# EAGLE design tick-wifi-mk-1.0 (EAGLE 7.5.0)
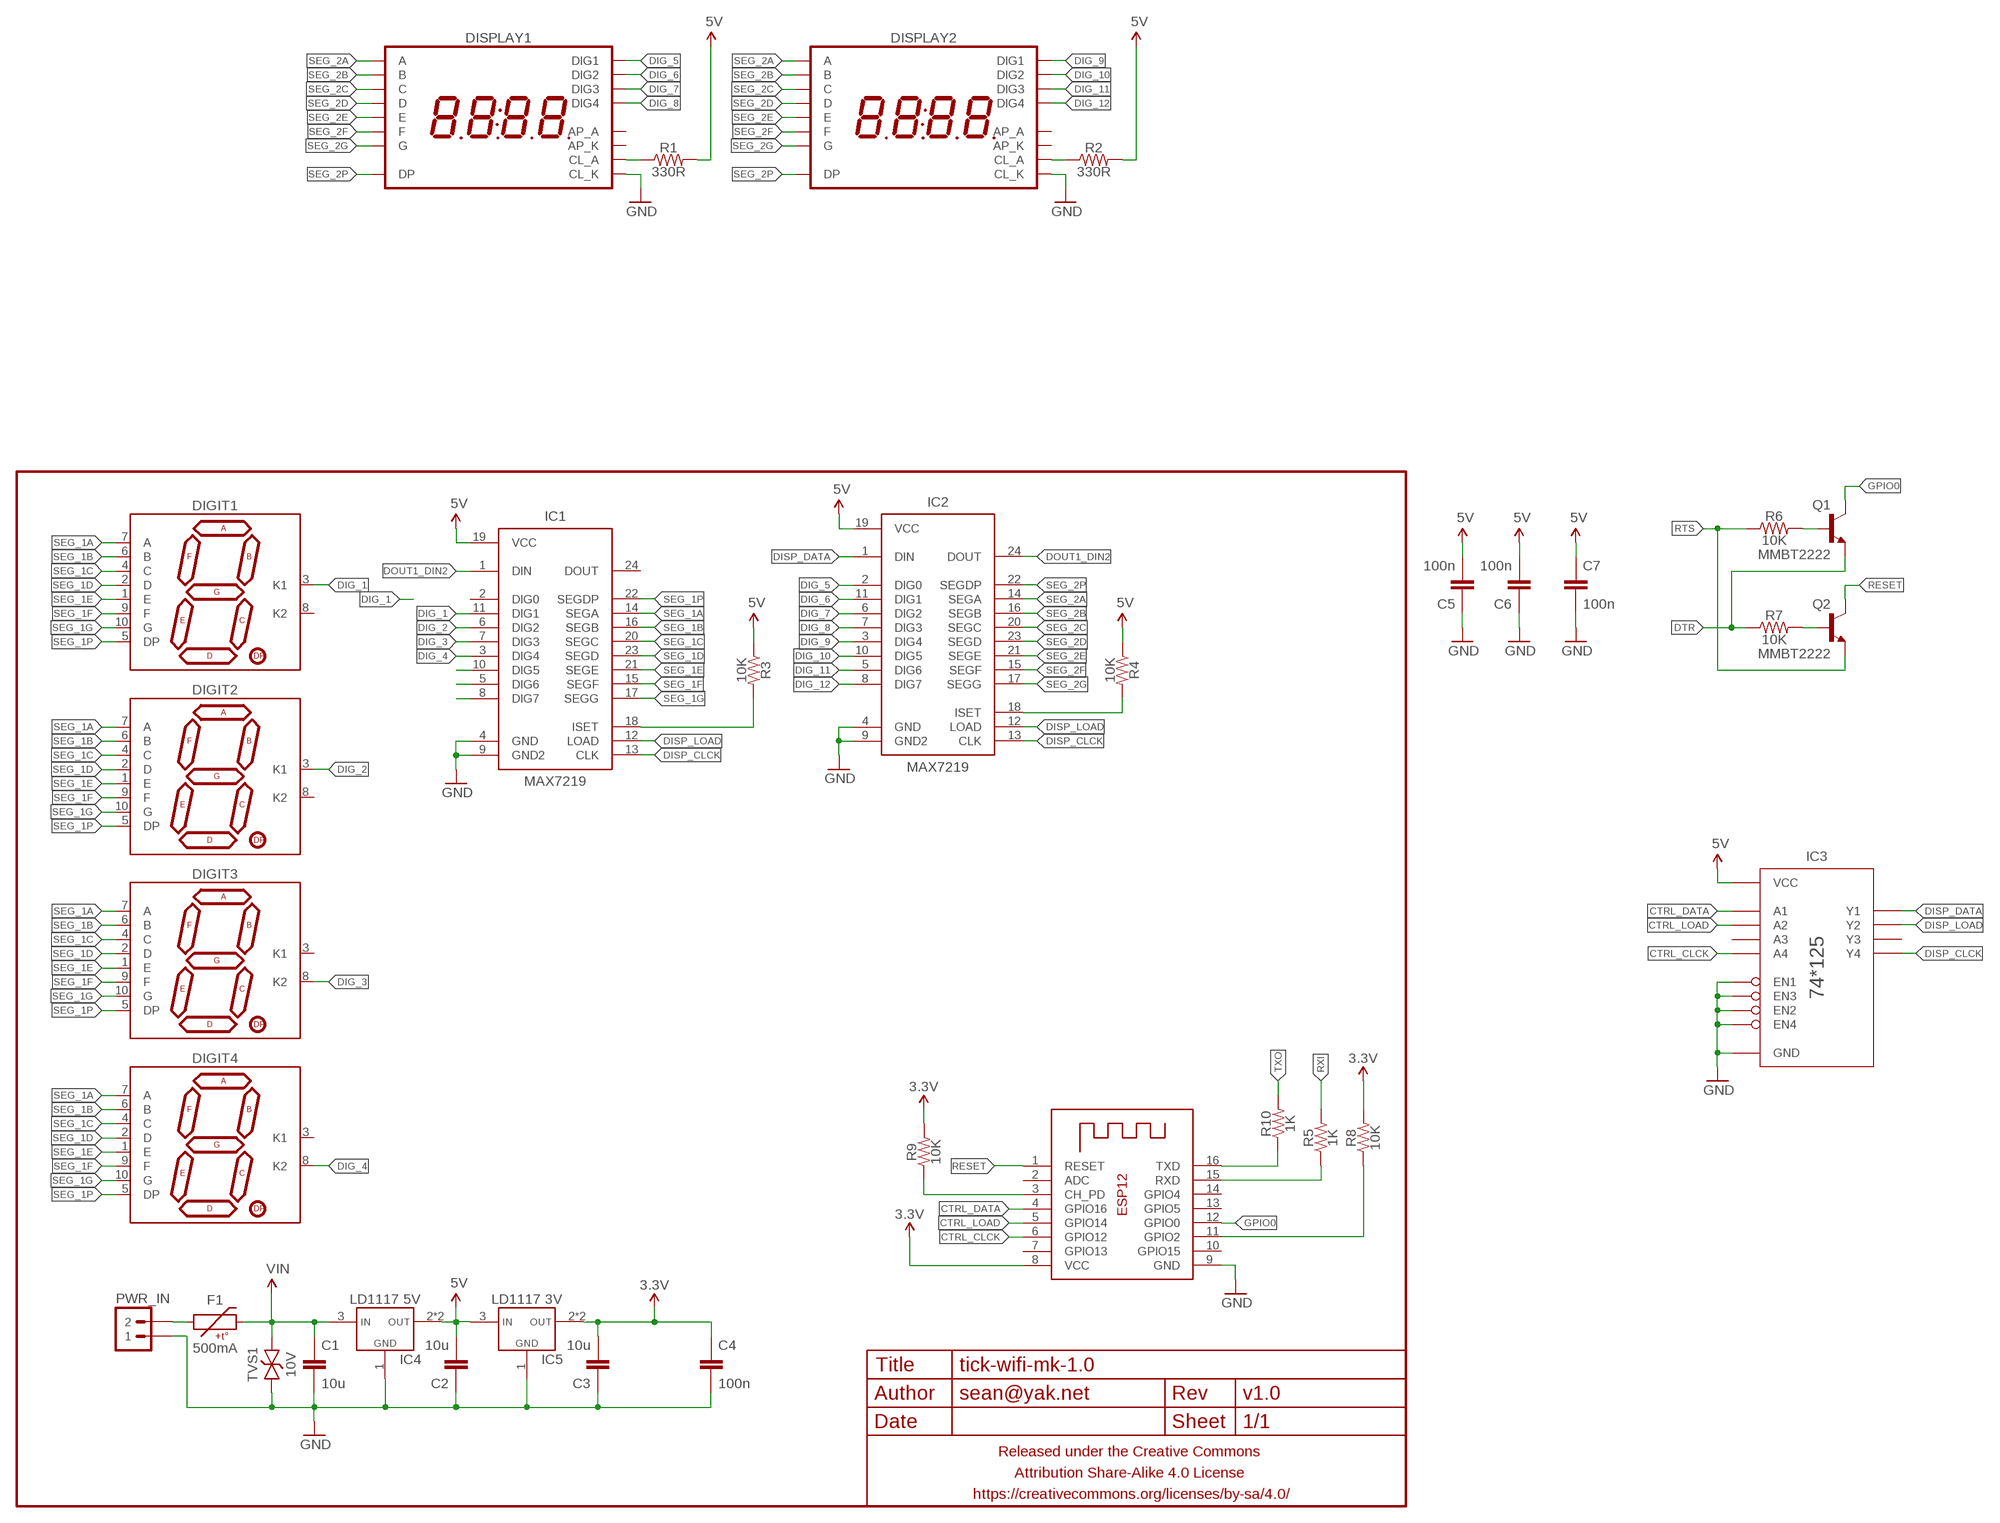
[diagram p0: schematic, sheet 1]

## Parts
C1  10u  CAPACITOR-CERAMICC1210  [C1210]
C2  10u  CAPACITOR-CERAMICC1210  [C1210]
C3  10u  CAPACITOR-CERAMICC1210  [C1210]
C4  100n  CAPACITOR-CERAMICC0603  [C0603]
C5  100n  CAPACITOR-CERAMICC0603  [C0603]
C6  100n  CAPACITOR-CERAMICC0603  [C0603]
C7  100n  CAPACITOR-CERAMICC0603  [C0603]
DIGIT1  7SEG_1DIGPTH-25.4MM-BARE  [7SEG_1DIG_25.4MM_NOSILK]
DIGIT2  7SEG_1DIGPTH-25.4MM-BARE  [7SEG_1DIG_25.4MM_NOSILK]
DIGIT3  7SEG_1DIGPTH-25.4MM-BARE  [7SEG_1DIG_25.4MM_NOSILK]
DIGIT4  7SEG_1DIGPTH-25.4MM-BARE  [7SEG_1DIG_25.4MM_NOSILK]
DISPLAY1  7SEG_4DIGIT_COLON_APOS  [7SEG_4DIG_10MM]
DISPLAY2  7SEG_4DIGIT_COLON_APOS  [7SEG_4DIG_10MM]
F1  500mA  PTCPTC-1210  [PTC-1210]
FRAME1  FRAME-LETTERNO_PACKAGE  [DUMMY]
IC1  MAX7219  MAX7219SOIC-W  [SO24W]
IC2  MAX7219  MAX7219SOIC-W  [SO24W]
IC3  74HC125  74125SOIC14  [SO14]
IC4  LD1117 5V  VREG_1117SOT223  [SOT223]
IC5  LD1117 3V  VREG_1117SOT223  [SOT223]
PWR_IN  M02PTH-CENTERED-R+  [1X02-CENTER-R+]
Q1  MMBT2222  TRANSISTOR_NPNMMBT2222A  [SOT23]
Q2  MMBT2222  TRANSISTOR_NPNMMBT2222A  [SOT23]
R1  330R  RESISTORR0805  [R0805]
R2  330R  RESISTORR0805  [R0805]
R3  10K  RESISTORR0603  [R0603]
R4  10K  RESISTORR0603  [R0603]
R5  1K  RESISTORR0603  [R0603]
R6  10K  RESISTORR0603  [R0603]
R7  10K  RESISTORR0603  [R0603]
R8  10K  RESISTORR0603  [R0603]
R9  10K  RESISTORR0603  [R0603]
R10  1K  RESISTORR0603  [R0603]
TVS1  10V  TVSSMA  [SMA-DIODE-TVS-BIDIR]
U1  ESP-12  [ESP-12]

## Nets
3.3V: C3.2 C4.1 IC5.2(VOUT) IC5.4(VOUT) R8.2 R9.2 U1.8(VCC)
5V: C2.2 C5.2 C6.2 C7.1 IC1.19(VCC) IC2.19(VCC) IC3.14(VCC) IC4.2(VOUT) IC4.4(VOUT) IC5.3(VIN) R1.2 R2.2 R3.1 R4.1
CTRL_CLCK: IC3.12(A4) U1.6(GPIO12)
CTRL_DATA: IC3.2(A1) U1.4(GPIO16)
CTRL_LOAD: IC3.5(A2) U1.5(GPIO14)
DIG_1: DIGIT1.3(K1) IC1.11(DIG1)
DIG_2: DIGIT2.3(K1) IC1.6(DIG2)
DIG_3: DIGIT3.8(K2) IC1.7(DIG3)
DIG_4: DIGIT4.8(K2) IC1.3(DIG4)
DIG_5: DISPLAY1.1(DIG1) IC2.2(DIG0)
DIG_6: DISPLAY1.2(DIG2) IC2.11(DIG1)
DIG_7: DISPLAY1.6(DIG3) IC2.6(DIG2)
DIG_8: DISPLAY1.8(DIG4) IC2.7(DIG3)
DIG_9: DISPLAY2.1(DIG1) IC2.3(DIG4)
DIG_10: DISPLAY2.2(DIG2) IC2.10(DIG5)
DIG_11: DISPLAY2.6(DIG3) IC2.5(DIG6)
DIG_12: DISPLAY2.8(DIG4) IC2.8(DIG7)
DISP_CLCK: IC1.13(CLK) IC2.13(CLK) IC3.11(Y4)
DISP_DATA: IC2.1(DIN) IC3.3(Y1)
DISP_LOAD: IC1.12(LOAD) IC2.12(LOAD) IC3.6(Y2)
DOUT1_DIN2: IC1.1(DIN) IC2.24(DOUT)
DTR: Q1.2(E) R7.1
GND: C1.2 C2.1 C3.1 C4.2 C5.1 C6.1 C7.2 DISPLAY1.12(CL_K) DISPLAY2.12(CL_K) IC1.4(GND) IC1.9(GND2) IC2.4(GND) IC2.9(GND2) IC3.1(EN1) IC3.4(EN2) IC3.7(GND) IC3.10(EN3) IC3.13(EN4) IC4.1(GND) IC5.1(GND) PWR_IN.1 TVS1.1 U1.9(GND)
GPIO0: Q1.3(C) U1.12(GPIO0)
N$1: F1.1 PWR_IN.2
N$2: IC2.18(ISET) R4.2
N$3: DISPLAY1.4(CL_A) R1.1
N$4: IC1.18(ISET) R3.2
N$5: DISPLAY2.4(CL_A) R2.1
N$6: R5.1 U1.15(RXD)
N$7: IC1.10(DIG5)
N$8: IC1.5(DIG6)
N$9: IC1.8(DIG7)
N$10: R8.1 U1.11(GPIO2)
N$11: Q1.1(B) R6.2
N$12: Q2.1(B) R7.2
N$13: R9.1 U1.3(CH_PD)
N$14: R10.1 U1.16(TXD)
RESET: Q2.3(C) U1.1(RESET)
RTS: Q2.2(E) R6.1
RXI: R5.2
SEG_1A: DIGIT1.7(A) DIGIT2.7(A) DIGIT3.7(A) DIGIT4.7(A) IC1.14(SEGA)
SEG_1B: DIGIT1.6(B) DIGIT2.6(B) DIGIT3.6(B) DIGIT4.6(B) IC1.16(SEGB)
SEG_1C: DIGIT1.4(C) DIGIT2.4(C) DIGIT3.4(C) DIGIT4.4(C) IC1.20(SEGC)
SEG_1D: DIGIT1.2(D) DIGIT2.2(D) DIGIT3.2(D) DIGIT4.2(D) IC1.23(SEGD)
SEG_1E: DIGIT1.1(E) DIGIT2.1(E) DIGIT3.1(E) DIGIT4.1(E) IC1.21(SEGE)
SEG_1F: DIGIT1.9(F) DIGIT2.9(F) DIGIT3.9(F) DIGIT4.9(F) IC1.15(SEGF)
SEG_1G: DIGIT1.10(G) DIGIT2.10(G) DIGIT3.10(G) DIGIT4.10(G) IC1.17(SEGG)
SEG_1P: DIGIT1.5(DP) DIGIT2.5(DP) DIGIT3.5(DP) DIGIT4.5(DP) IC1.22(SEGDP)
SEG_2A: DISPLAY1.14(A) DISPLAY2.14(A) IC2.14(SEGA)
SEG_2B: DISPLAY1.16(B) DISPLAY2.16(B) IC2.16(SEGB)
SEG_2C: DISPLAY1.13(C) DISPLAY2.13(C) IC2.20(SEGC)
SEG_2D: DISPLAY1.3(D) DISPLAY2.3(D) IC2.23(SEGD)
SEG_2E: DISPLAY1.5(E) DISPLAY2.5(E) IC2.21(SEGE)
SEG_2F: DISPLAY1.11(F) DISPLAY2.11(F) IC2.15(SEGF)
SEG_2G: DISPLAY1.15(G) DISPLAY2.15(G) IC2.17(SEGG)
SEG_2P: DISPLAY1.7(DP) DISPLAY2.7(DP) IC2.22(SEGDP)
TXO: R10.2
VIN: C1.1 F1.2 IC4.3(VIN) TVS1.2
Unconnected: DIGIT1.8(K2) DIGIT2.8(K2) DIGIT3.3(K1) DIGIT4.3(K1) DISPLAY1.9(AP_K) DISPLAY1.10(AP_A) DISPLAY2.9(AP_K) DISPLAY2.10(AP_A) IC1.2(DIG0) IC1.24(DOUT) IC3.8(Y3) IC3.9(A3) U1.2(ADC) U1.7(GPIO13) U1.10(GPIO15) U1.13(GPIO5) U1.14(GPIO4)

## Library data of the parts
C1-C7 = a_parts:CAPACITOR-CERAMIC: CAPACITOR, European symbol
DIGIT1-DIGIT4 = a_parts:7SEG_1DIG
DISPLAY1 DISPLAY2 = a_parts:7SEG_4DIGIT_COLON_APOS
F1 = a_parts:PTC: Resettable Fuse PTC Resettable Fuse. Spark Fun Electronics SKU : COM-08357
FRAME1 = a_parts:FRAME-LETTER: Schematic Frame Standard 8.5x11 US Letter frame; DESIGNER: sean@yak.net; VERSION: v1.0
IC1 IC2 = a_parts:MAX7219: 8-digit, 8-segment LED display driver, serial input
IC3 = a_parts:74*125
IC4 IC5 = a_parts:VREG_1117
PWR_IN = a_parts:M02: Standard 2-pin 0.1" header. Use with - straight break away headers ( PRT-00116) - right angle break away headers (PRT-00553) - swiss pins (PRT-00743) - machine pins (PRT-00117) - female headers (PRT-00115) Molex polarized connector foot print use with: PRT-08233 with associated crimp pins and housings. 2.54_SCREWTERM for use with PRT-10571. 3.5mm Screw Terminal footprints for PRT-08084 5mm Screw Terminal footprints for use with PRT-08433
Q1 Q2 = a_parts:TRANSISTOR_NPN: Generic NPN BJT MMBT2222A - TRANS-08049 (SOT-23, 1A 40V) MPSA42 - TRANS-09116 (SOT-23, 500mA 300V) MMBT5088LT1G - TRANS-11160 (SOT-23, 50 mA 30V) BC547 - COM-08928 <http://www.sparkfun.com/products/8928> (TO-92 45V 100mA) (1.Collector 2.Base 3.Emitter) 2N3904 - COM-00521 <http://www.sparkfun.com/products/521> (TO-92 40V 200mA) (1.Emitter 2.Base 3.Collector) P2N2222A - COM-12852 <http://www.sparkfun.com/products/12852> (TO-92 40V 600mA) (1.Collector 2.Base 3.Emitter)
R1-R10 = a_parts:RESISTOR: RESISTOR, American symbol
TVS1 = a_parts:TVS: Transient voltage suppressor- prevents ESD on inputs. Ignore package description- MBRA140 is NOT this type of part!!!
U1 = a_parts:ESP-12

## Board
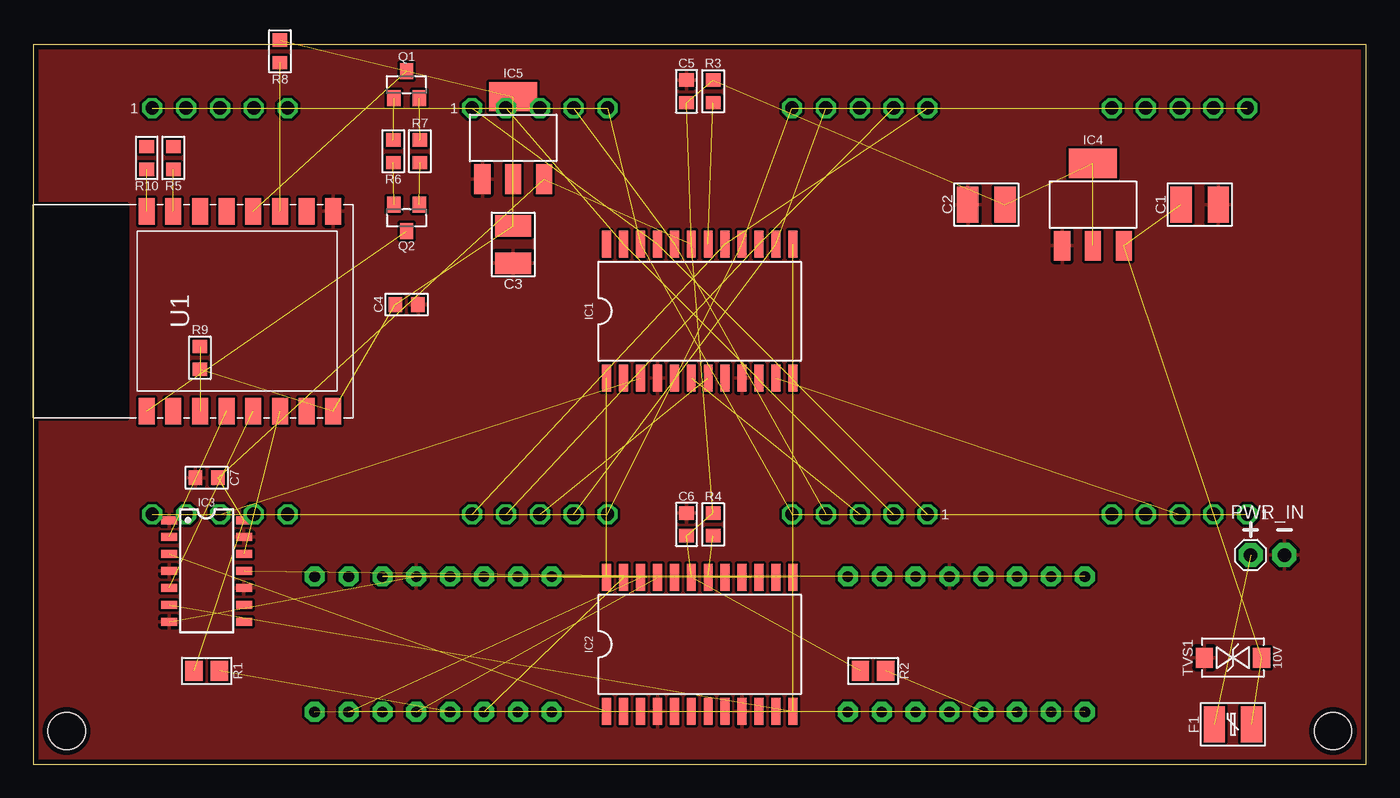
[diagram p1: board, top side]
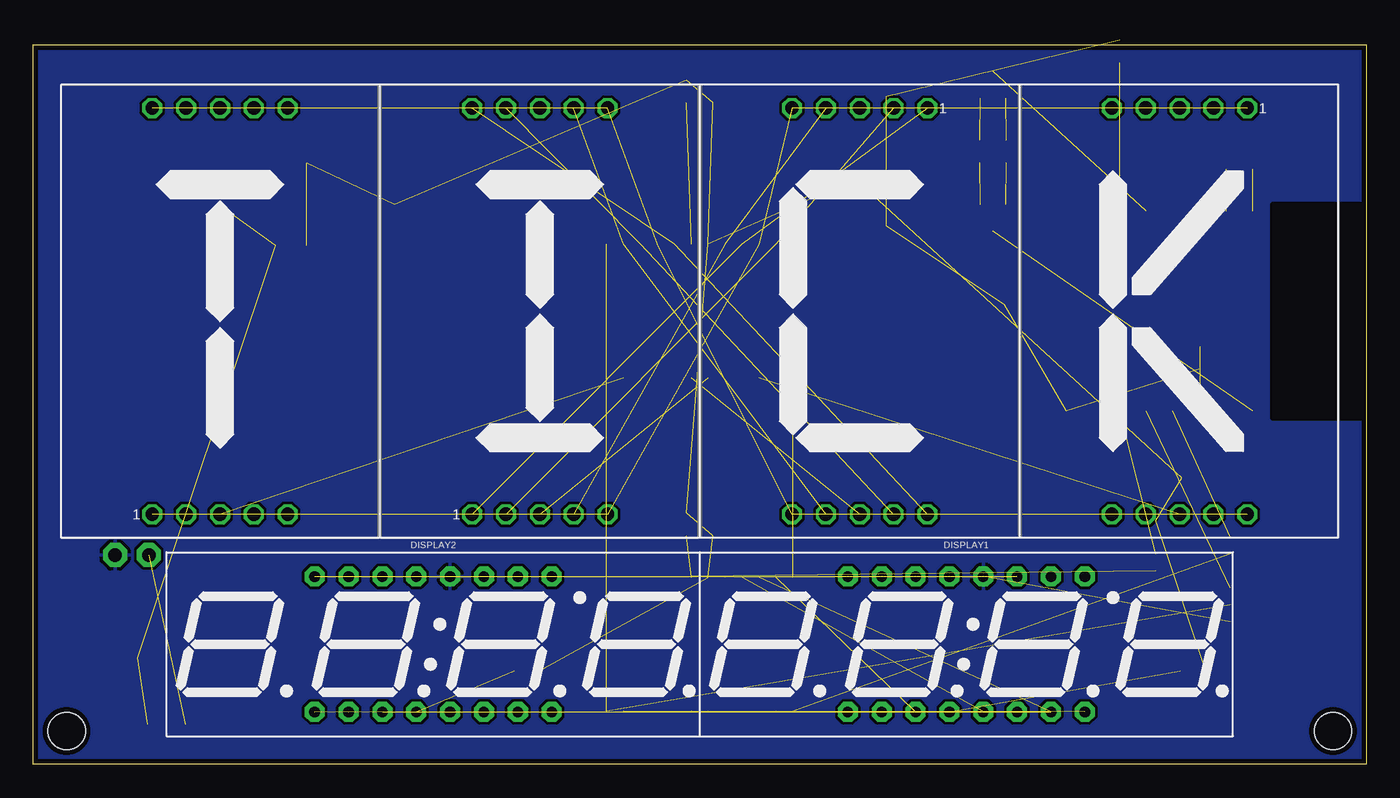
[diagram p2: board, bottom side, seen from below]

Size 100 x 54 mm. Coordinates in mm from the lower left corner, seen from the top.
Outline: 100,0 100,54 0,54 0,0 100,0
Copper layers (1*16): Top 0.0356mm / dielectric 1.5011mm / Bottom 0.0356mm
Design rules "LaenPCBOrder_2": minimum track width 6mil, minimum drill 13mil, track to track 6mil, track to pad 6mil, pad to pad 6mil, via to via 6mil, smd to smd 6mil, copper to edge 15mil, drill to drill 6mil, minimum pad ring 7mil, minimum via ring 7mil, stop-mask expansion 3mil, vias tented up to drill 20mil, thermal gap 10mil
Holes 2.8 mm at 2.5,2.5 97.5,2.5

### Footprints (pad centres in the part's own frame; a part is rotated, then mirrored left to right if it is on the bottom)
C1210 = smd 1.6 x 2.7: 1 -1.4,0; 2 1.4,0
C0603 = smd 1 x 1.1: 1 -0.85,0; 2 0.85,0
7SEG_1DIG_25.4MM_NOSILK = drill 1 pad 1.5 octagon: 1 -5.08,-15.24; 2 -2.54,-15.24; 3 0,-15.24; 4 2.54,-15.24; 5 5.08,-15.24; 6 5.08,15.24; 7 2.54,15.24; 8 0,15.24; 9 -2.54,15.24; 10 -5.08,15.24
7SEG_4DIG_10MM = drill 0.8 pad 1.5 octagon: 1 -8.89,-5.08; 2 -6.35,-5.08; 3 -3.81,-5.08; 4 -1.27,-5.08; 5 1.27,-5.08; 6 3.81,-5.08; 7 6.35,-5.08; 8 8.89,-5.08; 9 8.89,5.08; 10 6.35,5.08; 11 3.81,5.08; 12 1.27,5.08; 13 -1.27,5.08; 14 -3.81,5.08; 15 -6.35,5.08; 16 -8.89,5.08
PTC-1210 = smd 1.6 x 2.7: 1 -1.4,0; 2 1.4,0
SO24W = smd 0.66 x 2.032: 1 -6.985,-5.029; 2 -5.715,-5.029; 3 -4.445,-5.029; 4 -3.175,-5.029; 5 -1.905,-5.029; 6 -0.635,-5.029; 7 0.635,-5.029; 8 1.905,-5.029; 9 3.175,-5.029; 10 4.445,-5.029; 11 5.715,-5.029; 12 6.985,-5.029; 13 6.985,5.029; 14 5.715,5.029; 15 4.445,5.029; 16 3.175,5.029; 17 1.905,5.029; 18 0.635,5.029; 19 -0.635,5.029; 20 -1.905,5.029; 21 -3.175,5.029; 22 -4.445,5.029; 23 -5.715,5.029; 24 -6.985,5.029
SO14 = smd 0.6 x 1.2: 1 -3.81,-2.8; 2 -2.54,-2.8; 3 -1.27,-2.8; 4 0,-2.8; 5 1.27,-2.8; 6 2.54,-2.8; 7 3.81,-2.8; 8 3.81,2.8; 9 2.54,2.8; 10 1.27,2.8; 11 0,2.8; 12 -1.27,2.8; 13 -2.54,2.8; 14 -3.81,2.8
SOT223 = smd 1.219 x 2.235: 1 -2.311,-3.099; 2 0,-3.099; 3 2.311,-3.099 | smd 3.6 x 2.2: 4 0,3.099
1X02-CENTER-R+ = drill 1 pad 1.8 octagon: 1 -1.27,0; 2 1.27,0
SOT23 = smd 1 x 1.2: 1 -0.95,-1; 2 0.95,-1; 3 0,1
R0805 = smd 1.3 x 1.5: 1 -0.95,0; 2 0.95,0
R0603 = smd 1 x 1.1: 1 -0.85,0; 2 0.85,0
SMA-DIODE-TVS-BIDIR = smd 1.3 x 1.5: 1 -2.15,0; 2 2.15,0
ESP-12 = smd 2 x 1.2: 1 -7.5,4.5; 2 -7.5,2.5; 3 -7.5,0.5; 4 -7.5,-1.5; 5 -7.5,-3.5; 6 -7.5,-5.5; 7 -7.5,-7.5; 8 -7.5,-9.5; 9 7.5,-9.5; 10 7.5,-7.5; 11 7.5,-5.5; 12 7.5,-3.5; 13 7.5,-1.5; 14 7.5,0.5; 15 7.5,2.5; 16 7.5,4.5

### Placement (x,y rotation side)
C1  87.5,42 0 top
C2  71.5,42 0 top
C3  36,39 90 top
C4  28,34.5 0 top
C5  49,50.5 270 top
C6  49,18 270 top
C7  13,21.5 180 top
DIGIT1  86,34 0 bottom
DIGIT2  62,34 0 bottom
DIGIT3  38,34 180 bottom
DIGIT4  14,34 180 bottom
DISPLAY1  30,9 0 bottom
DISPLAY2  70,9 0 bottom
F1  90,3 0 top
FRAME1  0,-0.5 0 top
IC1  50,34 0 top
IC2  50,9 0 top
IC3  13,14.5 270 top
IC4  79.5,42 0 top
IC5  36,47 0 top
PWR_IN  92.6,15.7 180 top
Q1  28,51 0 top
Q2  28,41 180 top
R1  13,7 180 top
R2  63,7 180 top
R3  51,50.5 270 top
R4  51,18 270 top
R5  10.5,45.5 90 top
R6  27,46 90 top
R7  29,46 270 top
R8  18.5,53.5 90 top
R9  12.5,30.5 270 top
R10  8.5,45.5 90 top
TVS1  90,8 0 top
U1  13,34 90 top
U$1  [TICK_SYMBOL]  50,34 0 bottom
U$2  [COW_SMALL]  57.7,65.5 0 top  (outside the outline)
U$3  [OSHWLOGO_SILKONLY]  6.2,63.3 0 top  (outside the outline)
U$4  [CC-BY-SA-4.0-NO-URL]  76.1,66.8 0 top  (outside the outline)

### Tracks (layer width: path | path; a pad name or v marks a point on that pad's centre or on a via)
3.3V  (6 unrouted)
5V  (13 unrouted)
CTRL_CLCK  (1 unrouted)
CTRL_DATA  (1 unrouted)
CTRL_LOAD  (1 unrouted)
DIG_1  (1 unrouted)
DIG_2  (1 unrouted)
DIG_3  (1 unrouted)
DIG_4  (1 unrouted)
DIG_5  (1 unrouted)
DIG_6  (1 unrouted)
DIG_7  (1 unrouted)
DIG_8  (1 unrouted)
DIG_9  (1 unrouted)
DIG_10  (1 unrouted)
DIG_11  (1 unrouted)
DIG_12  (1 unrouted)
DISP_CLCK  (2 unrouted)
DISP_DATA  (1 unrouted)
DISP_LOAD  (2 unrouted)
DOUT1_DIN2  (1 unrouted)
DTR  (1 unrouted)
GND  (2 unrouted)
  pour Top (isolate 0.2): 0,54 100,54 100,0 0,0
  pour Bottom (isolate 0.2): 0,54 100,54 100,0 0,0
GPIO0  (1 unrouted)
N$1  (1 unrouted)
N$2  (1 unrouted)
N$3  (1 unrouted)
N$4  (1 unrouted)
N$5  (1 unrouted)
N$6  (1 unrouted)
N$10  (1 unrouted)
N$11  (1 unrouted)
N$12  (1 unrouted)
N$13  (1 unrouted)
N$14  (1 unrouted)
RESET  (1 unrouted)
RTS  (1 unrouted)
SEG_1A  (4 unrouted)
SEG_1B  (4 unrouted)
SEG_1C  (4 unrouted)
SEG_1D  (4 unrouted)
SEG_1E  (4 unrouted)
SEG_1F  (4 unrouted)
SEG_1G  (4 unrouted)
SEG_1P  (4 unrouted)
SEG_2A  (2 unrouted)
SEG_2B  (2 unrouted)
SEG_2C  (2 unrouted)
SEG_2D  (2 unrouted)
SEG_2E  (2 unrouted)
SEG_2F  (2 unrouted)
SEG_2G  (2 unrouted)
SEG_2P  (2 unrouted)
VIN  (3 unrouted)

### Text on the board
tPlace: by schizobovine / <sean@yak.net> | 7.5-12V | Terribly Illuminated Chronology Keeper | Now With WiFAIL Technology!
bPlace: Now With WiFAIL Technology! | Terribly Illuminated Chronology Keeper